# Altium schematic sheet HDMI.SchDoc
size A3; DocumentNumber: 9; SheetNumber: 9; SheetTotal: 9; PageSetup: Record=PageOptions|CenterHorizontal=True|CenterVertical=True|PrintScale=0.97|XCorrection=1.00|YCorrection=1.00|PrintKind=1|BorderSize=5000000|LeftOffset=0|BottomOffset=0|Orientation=2|PaperLength=2970|PaperWidth=2100|Scale=100|PaperSource=7|PrintQuality=600|MediaType=1|DitherType=10|PaperKind=A4|PrintScaleMode=1
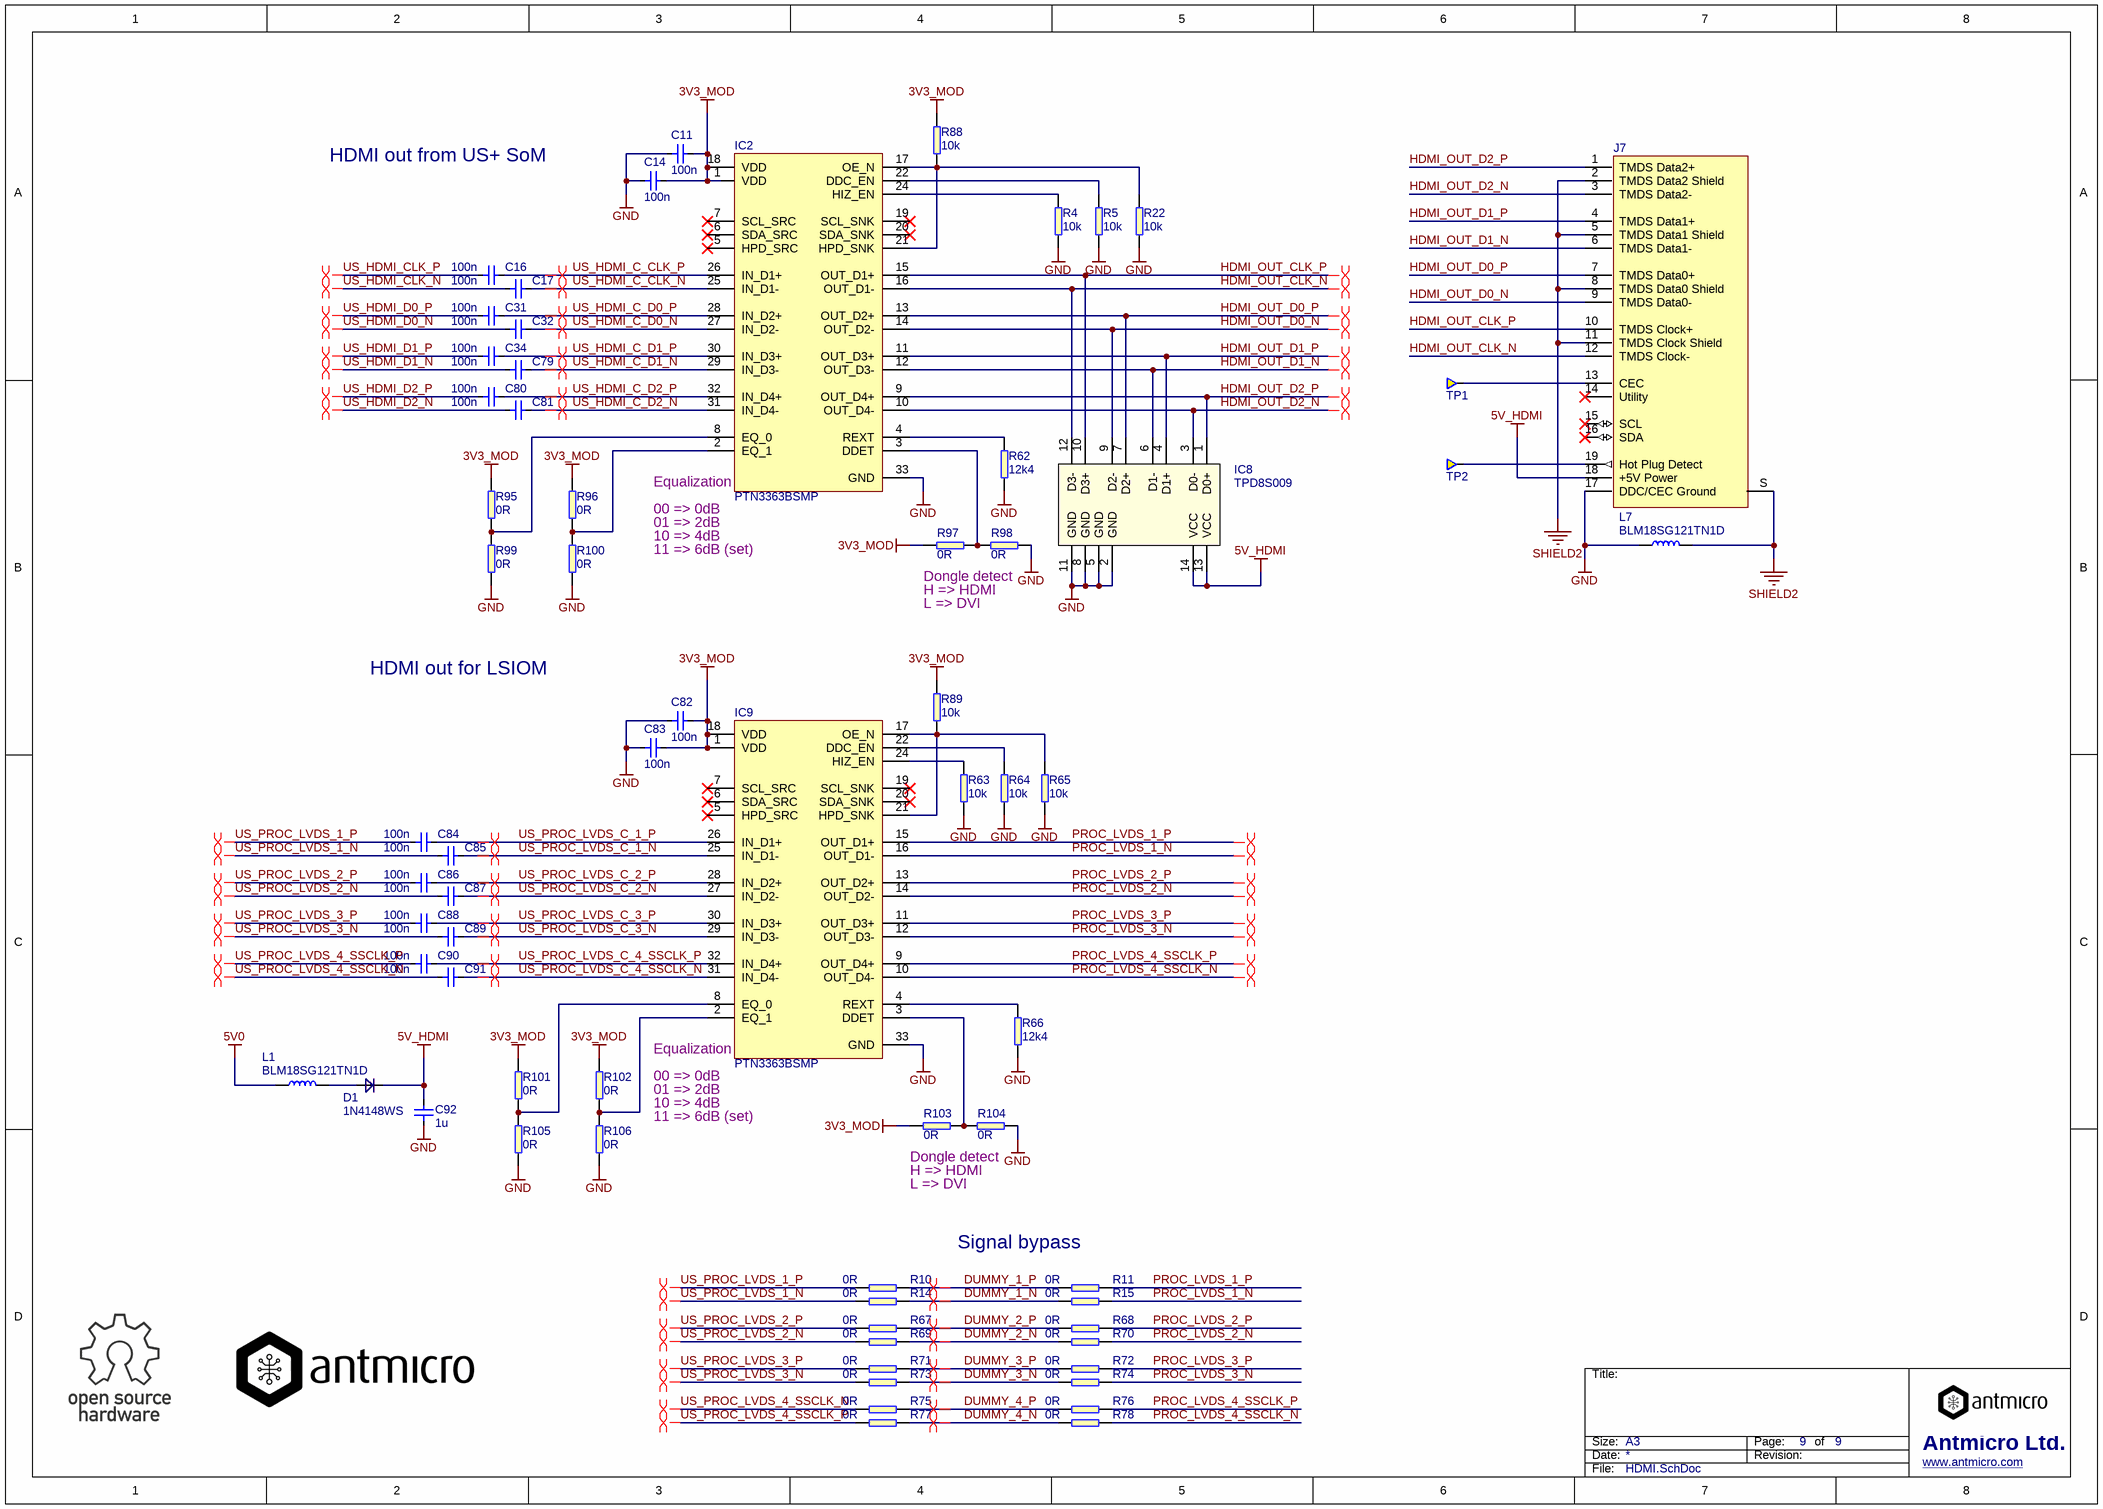
[diagram p0: HDMI.SchDoc]

## Parts
C11  100n  [0603]
C14  100n  [0603]
C16  100n  [0402]
C17  100n  [0402]
C31  100n  [0402]
C32  100n  [0402]
C34  100n  [0402]
C79  100n  [0402]
C80  100n  [0402]
C81  100n  [0402]
C82  100n  [0603]
C83  100n  [0603]
C84  100n  [0402]
C85  100n  [0402]
C86  100n  [0402]
C87  100n  [0402]
C88  100n  [0402]
C89  100n  [0402]
C90  100n  [0402]
C91  100n  [0402]
C92  1u  [0603]
D1  1N4148WS  [SOD-323]
IC2  PTN3363BSMP  [QFN-32]
IC8  TPD8S009  [SON-15]
IC9  PTN3363BSMP  [QFN-32]
J7  (no value)  [Molex_HDMI_471511001]
L1  BLM18SG121TN1D  [0603]
L7  BLM18SG121TN1D  [0603]
R4  10k  [0402]
R5  10k  [0402]
R10  0R  [0402]
R11  0R  [0402]
R14  0R  [0402]
R15  0R  [0402]
R22  10k  [0402]
R62  12k4  [0603]
R63  10k  [0402]
R64  10k  [0402]
R65  10k  [0402]
R66  12k4  [0603]
R67  0R  [0402]
R68  0R  [0402]
R69  0R  [0402]
R70  0R  [0402]
R71  0R  [0402]
R72  0R  [0402]
R73  0R  [0402]
R74  0R  [0402]
R75  0R  [0402]
R76  0R  [0402]
R77  0R  [0402]
R78  0R  [0402]
R88  10k  [0402]
R89  10k  [0402]
R95  0R  [0402]
R96  0R  [0402]
R97  0R  [0402]
R98  0R  [0402]
R99  0R  [0402]
R100  0R  [0402]
R101  0R  [0402]
R102  0R  [0402]
R103  0R  [0402]
R104  0R  [0402]
R105  0R  [0402]
R106  0R  [0402]
TP1  *  [Testpad]  (value not drawn)  (no BOM)
TP2  *  [Testpad]  (value not drawn)  (no BOM)

## Nets
3V3_MOD: C11.2 C14.2 C82.2 C83.2 IC2.1(VDD) IC2.18(VDD) IC9.1(VDD) IC9.18(VDD) R88.1 R89.1 R95.2 R96.2 R97.2 R101.2 R102.2 R103.2
5V0: L1.1
5V_HDMI: C92.2 D1.C IC8.13(VCC) IC8.14(VCC) J7.18(+5V_Power)
GND: C11.1 C14.1 C82.1 C83.1 C92.1 IC2.33(GND) IC8.2(GND) IC8.5(GND) IC8.8(GND) IC8.11(GND) IC9.33(GND) J7.17(DDC/CEC_Ground) L7.1 R4.2 R5.2 R22.2 R62.1 R63.2 R64.2 R65.2 R66.1 R98.1 R99.1 R100.1 R104.1 R105.1 R106.1
SHIELD2: J7.2(TMDS_Data2_Shield) J7.5(TMDS_Data1_Shield) J7.8(TMDS_Data0_Shield) J7.11(TMDS_Clock_Shield) J7.S(SH) L7.2
DUMMY_1_N: R14.2 R15.1
DUMMY_1_P: R10.2 R11.1
DUMMY_2_N: R69.2 R70.1
DUMMY_2_P: R67.2 R68.1
DUMMY_3_N: R73.2 R74.1
DUMMY_3_P: R71.2 R72.1
DUMMY_4_N: R77.2 R78.1
DUMMY_4_P: R75.2 R76.1
HDMI_OUT_CLK_N: IC2.16(OUT_D1-) IC8.12(D3-) J7.12(TMDS_Clock-)
HDMI_OUT_CLK_P: IC2.15(OUT_D1+) IC8.10(D3+) J7.10(TMDS_Clock+)
HDMI_OUT_D0_N: IC2.14(OUT_D2-) IC8.9(D2-) J7.9(TMDS_Data0-)
HDMI_OUT_D0_P: IC2.13(OUT_D2+) IC8.7(D2+) J7.7(TMDS_Data0+)
HDMI_OUT_D1_N: IC2.12(OUT_D3-) IC8.6(D1-) J7.6(TMDS_Data1-)
HDMI_OUT_D1_P: IC2.11(OUT_D3+) IC8.4(D1+) J7.4(TMDS_Data1+)
HDMI_OUT_D2_N: IC2.10(OUT_D4-) IC8.3(D0-) J7.3(TMDS_Data2-)
HDMI_OUT_D2_P: IC2.9(OUT_D4+) IC8.1(D0+) J7.1(TMDS_Data2+)
PROC_LVDS_1_N: IC9.16(OUT_D1-) R15.2
PROC_LVDS_1_P: IC9.15(OUT_D1+) R11.2
PROC_LVDS_2_N: IC9.14(OUT_D2-) R70.2
PROC_LVDS_2_P: IC9.13(OUT_D2+) R68.2
PROC_LVDS_3_N: IC9.12(OUT_D3-) R74.2
PROC_LVDS_3_P: IC9.11(OUT_D3+) R72.2
PROC_LVDS_4_SSCLK_N: IC9.10(OUT_D4-) R78.2
PROC_LVDS_4_SSCLK_P: IC9.9(OUT_D4+) R76.2
US_HDMI_C_CLK_N: C17.2 IC2.25(IN_D1-)
US_HDMI_C_CLK_P: C16.2 IC2.26(IN_D1+)
US_HDMI_C_D0_N: C32.2 IC2.27(IN_D2-)
US_HDMI_C_D0_P: C31.2 IC2.28(IN_D2+)
US_HDMI_C_D1_N: C79.2 IC2.29(IN_D3-)
US_HDMI_C_D1_P: C34.2 IC2.30(IN_D3+)
US_HDMI_C_D2_N: C81.2 IC2.31(IN_D4-)
US_HDMI_C_D2_P: C80.2 IC2.32(IN_D4+)
US_HDMI_CLK_N: C17.1
US_HDMI_CLK_P: C16.1
US_HDMI_D0_N: C32.1
US_HDMI_D0_P: C31.1
US_HDMI_D1_N: C79.1
US_HDMI_D1_P: C34.1
US_HDMI_D2_N: C81.1
US_HDMI_D2_P: C80.1
US_PROC_LVDS_1_N: C85.1 R14.1
US_PROC_LVDS_1_P: C84.1 R10.1
US_PROC_LVDS_2_N: C87.1 R69.1
US_PROC_LVDS_2_P: C86.1 R67.1
US_PROC_LVDS_3_N: C89.1 R73.1
US_PROC_LVDS_3_P: C88.1 R71.1
US_PROC_LVDS_4_SSCLK_N: C91.1 R75.1
US_PROC_LVDS_4_SSCLK_P: C90.1 R77.1
US_PROC_LVDS_C_1_N: C85.2 IC9.25(IN_D1-)
US_PROC_LVDS_C_1_P: C84.2 IC9.26(IN_D1+)
US_PROC_LVDS_C_2_N: C87.2 IC9.27(IN_D2-)
US_PROC_LVDS_C_2_P: C86.2 IC9.28(IN_D2+)
US_PROC_LVDS_C_3_N: C89.2 IC9.29(IN_D3-)
US_PROC_LVDS_C_3_P: C88.2 IC9.30(IN_D3+)
US_PROC_LVDS_C_4_SSCLK_N: C91.2 IC9.31(IN_D4-)
US_PROC_LVDS_C_4_SSCLK_P: C90.2 IC9.32(IN_D4+)
NetD1_A: D1.A L1.2
NetIC2_2: IC2.2(EQ_1) R96.1 R100.2
NetIC2_3: IC2.3(DDET) R97.1 R98.2
NetIC2_4: IC2.4(REXT) R62.2
NetIC2_8: IC2.8(EQ_0) R95.1 R99.2
NetIC2_17: IC2.17(OE_N) IC2.21(HPD_SNK) R22.1 R88.2
NetIC2_22: IC2.22(DDC_EN) R5.1
NetIC2_24: IC2.24(HIZ_EN) R4.1
NetIC9_2: IC9.2(EQ_1) R102.1 R106.2
NetIC9_3: IC9.3(DDET) R103.1 R104.2
NetIC9_4: IC9.4(REXT) R66.2
NetIC9_8: IC9.8(EQ_0) R101.1 R105.2
NetIC9_17: IC9.17(OE_N) IC9.21(HPD_SNK) R65.1 R89.2
NetIC9_22: IC9.22(DDC_EN) R64.1
NetIC9_24: IC9.24(HIZ_EN) R63.1
NetJ7_13: J7.13(CEC) TP1.1
NetJ7_19: J7.19(Hot_Plug_Detect) TP2.1

Not connected (* = marked no-connect by the designer): IC2 5(HPD_SRC)* 6(SDA_SRC)* 7(SCL_SRC)* 19(SCL_SNK)* 20(SDA_SNK)*; IC9 5(HPD_SRC)* 6(SDA_SRC)* 7(SCL_SRC)* 19(SCL_SNK)* 20(SDA_SNK)*; J7 14(Utility)* 15(SCL)* 16(SDA)*

## Layout directives
differential pair: DUMMY_1_N, DUMMY_1_P, DUMMY_2_N, DUMMY_2_P, DUMMY_3_N, DUMMY_3_P, DUMMY_4_N, DUMMY_4_P, HDMI_OUT_CLK_N, HDMI_OUT_CLK_P, HDMI_OUT_D0_N, HDMI_OUT_D0_P, HDMI_OUT_D1_N, HDMI_OUT_D1_P, HDMI_OUT_D2_N, HDMI_OUT_D2_P, PROC_LVDS_1_N, PROC_LVDS_1_P, PROC_LVDS_2_N, PROC_LVDS_2_P, PROC_LVDS_3_N, PROC_LVDS_3_P, PROC_LVDS_4_SSCLK_N, PROC_LVDS_4_SSCLK_P, US_HDMI_C_CLK_N, US_HDMI_C_CLK_P, US_HDMI_C_D0_N, US_HDMI_C_D0_P, US_HDMI_C_D1_N, US_HDMI_C_D1_P, US_HDMI_C_D2_N, US_HDMI_C_D2_P, US_HDMI_CLK_N, US_HDMI_CLK_P, US_HDMI_D0_N, US_HDMI_D0_P, US_HDMI_D1_N, US_HDMI_D1_P, US_HDMI_D2_N, US_HDMI_D2_P, US_PROC_LVDS_1_N, US_PROC_LVDS_1_P, US_PROC_LVDS_2_N, US_PROC_LVDS_2_P, US_PROC_LVDS_3_N, US_PROC_LVDS_3_P, US_PROC_LVDS_4_SSCLK_N, US_PROC_LVDS_4_SSCLK_P, US_PROC_LVDS_C_1_N, US_PROC_LVDS_C_1_P, US_PROC_LVDS_C_2_N, US_PROC_LVDS_C_2_P, US_PROC_LVDS_C_3_N, US_PROC_LVDS_C_3_P, US_PROC_LVDS_C_4_SSCLK_N, US_PROC_LVDS_C_4_SSCLK_P

## Notes on the sheet
- HDMI out from US+ SoM
- (near IC2) 00 => 0dB
- (near IC2) Equalization
- (near IC2) 01 => 2dB
- 10 => 4dB
- 11 => 6dB (set)
- Dongle detect
- H => HDMI
- L => DVI
- HDMI out for LSIOM
- (near IC9) Equalization
- (near IC9) 00 => 0dB
- 01 => 2dB
- Signal bypass
- Title:
- Size:
- Date:
- A3
- Revision:
- Page:
- of
- Antmicro Ltd.
- File:
- www.antmicro.com

## Library data of the parts
C11 C14 C82 C83 = C_100n_0603: MLCC SMT Capacitor 100nF 0603; Manufacturer: WALSIN; MPN: 0603B104K500CT; Value: 100n; Part Number: C_100n_0603
C16 C17 C31 C32 C34 C79-C81 C84-C91 = C_100n_0402: MLCC SMT Capacitor 100nF 0402; Manufacturer: MULTICOMP; MPN: MC0402X104M100CT; Value: 100n; Part Number: C_100n_0402
C92 = C_1u_0603: MLCC SMT Capacitor 1uF 0603; Manufacturer: MULTICOMP; MPN: MC0603X105M6R3CT; Value: 1u; Part Number: C_1u_0603
D1 = 1N4148WS: Diode small signal; Manufacturer: MULTICOMP; Part Number: 1N4148WS; Value: 1N4148WS; MPN: 1N4148WS
IC2 IC9 = PTN3363BSMP: HDMI level shifter; Manufacturer: NXP; Part Number: PTN3363BSMP; Value: PTN3363BSMP; MPN: PTN3363BSMP
IC8 = TPD8S009: 8-Channel ESD Protection for DisplayPort and HDMI; Manufacturer: TEXAS INSTRUMENTS; MPN: TPD8S009DSMR; Part Number: TPD8S009; Value: TPD8S009
J7 = CON-Molex-471511001: Header right angle HDMI; Manufacturer: MOLEX; MPN: 47151-1001; Part Number: CON-Molex-471511001
L1 L7 = BLM18SG121TN1D: FERRITE BEAD, 0.025OHM, 3A, 0603; Manufacturer: MURATA; Part Number: BLM18SG121TN1D; Value: BLM18SG121TN1D; MPN: BLM18SG121TN1D
R4 R5 R22 R63-R65 R88 R89 = R_10k_0402: SMT Resistor 0402; Manufacturer: MULTICOMP; MPN: MCMR04X1002FTL; Value: 10k; Part Number: R_10k_0402
R10 R11 R14 R15 R67-R78 R95-R106 = R_0R_0402: SMT Resistor 0402; Manufacturer: MULTICOMP; MPN: MCMR04X000 PTL; Part Number: R_0R_0402; Value: 0R
R62 R66 = R_12k4_0603_1%: SMT Resistor 12k4 0603 1%; Manufacturer: Vishay; MPN: CRCW060312K4FKEA; Value: 12k4; Part Number: R_12k4_0603_1%
TP1 TP2 = Testpad: Testpad 2mm diameter; Part Number: Testpad